# EAGLE design oneKey_2020 (EAGLE 9.6.2)
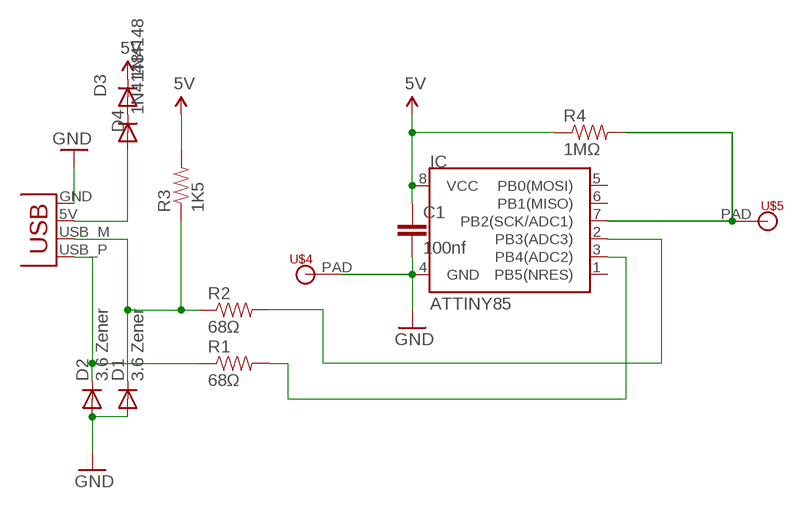
[diagram p0: schematic, sheet 1]

## Parts
C1  100nf  CAPKIT  [CAP-PTH-SMALL-KIT]
D1  3.6 Zener  1N4148  [DO35-10]
D2  3.6 Zener  1N4148  [DO35-10]
D3  1N4148  [DO35-10]
D4  1N4148  [DO35-10]
IC  ATTINY85  ATTINY45DIP8  [DIP08]
R1  68Ω  RESISTORAXIAL-0.3  [AXIAL-0.3]
R2  68Ω  RESISTORAXIAL-0.3  [AXIAL-0.3]
R3  1K5  RESISTORAXIAL-0.3  [AXIAL-0.3]
R4  1MΩ  RESISTORAXIAL-0.3  [AXIAL-0.3]
U$4  MICROBIT_PAD  [MICROBIT_PAD]
U$5  MICROBIT_PAD  [MICROBIT_PAD]
X1  USBPCB  [USB-A-PCB]

## Nets
5V: C1.1 D3.C IC.8(VCC) R3.P$2 R4.P$1
GND: C1.2 D1.A D2.A IC.4(GND) U$4.PAD X1.GND
N$1: IC.2(PB3(ADC3)) R2.P$2
N$2: IC.7(PB2(SCK/ADC1)) R4.P$2 U$5.PAD
N$3: D3.A D4.C
N$4: D4.A X1.5V(VBUS)
N$6: IC.3(PB4(ADC2)) R1.P$2
N$10: D1.C R2.P$1 R3.P$1 X1.USB_M(D-)
N$11: D2.C R1.P$1 X1.USB_P(D+)
Unconnected: IC.1(PB5(NRES)) IC.5(PB0(MOSI)) IC.6(PB1(MISO))

## Library data of the parts
C1 = SparkFun:CAP: Capacitor Standard 0603 ceramic capacitor, and 0.1" leaded capacitor.
D1-D4 = diode:1N4148: DIODE high speed (Philips)
IC = SparkFun:ATTINY45: Atmel ATTiny45
R1-R4 = SparkFun:RESISTOR: Resistor Basic schematic elements and footprints for 0603, 1206, and PTH resistors.
U$4 U$5 = microbit:MICROBIT_PAD
X1 = SparkFun:USB: USB Connectors USB-B-PTH is fully proven SKU : PRT-00139 USB-miniB is fully proven SKU : PRT-00587 USB-A-PCB is untested. USB-A-H is throughly reviewed, but untested. Spark Fun Electronics SKU : PRT-00437 USB-B-SMT is throughly reviewed, but untested. Needs silkscreen touching up. USB-A-S has not been used/tested USB-MB-H has not been used/tested

## Board
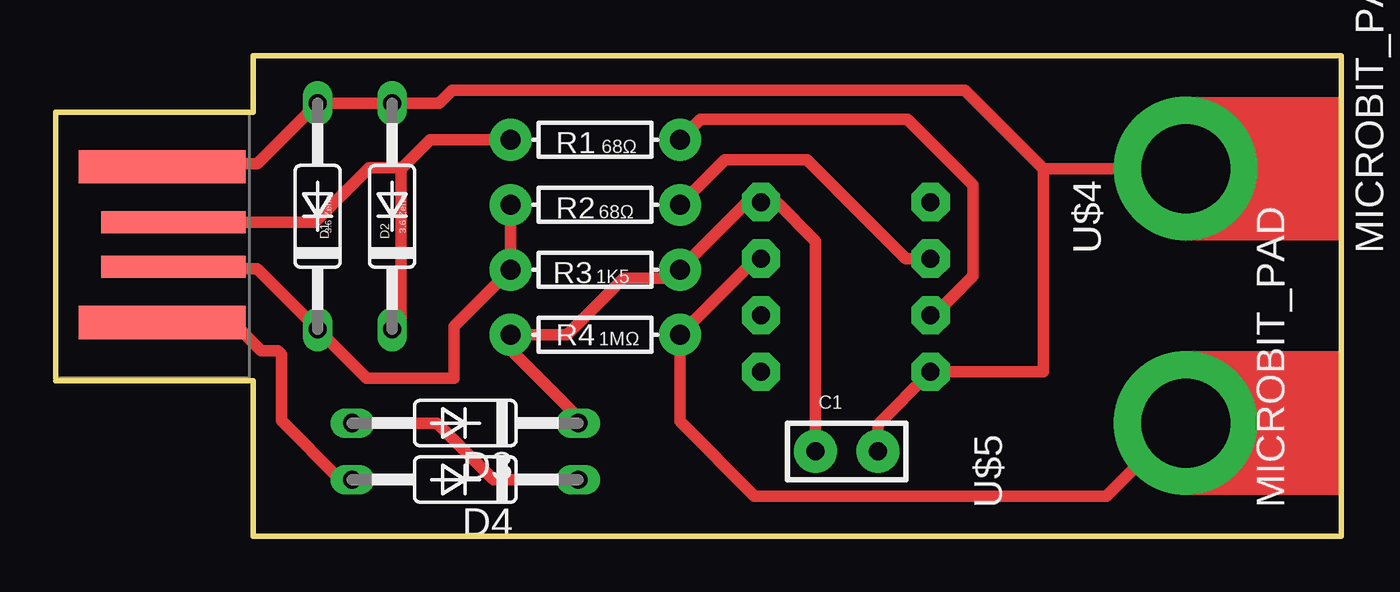
[diagram p1: board, top side]
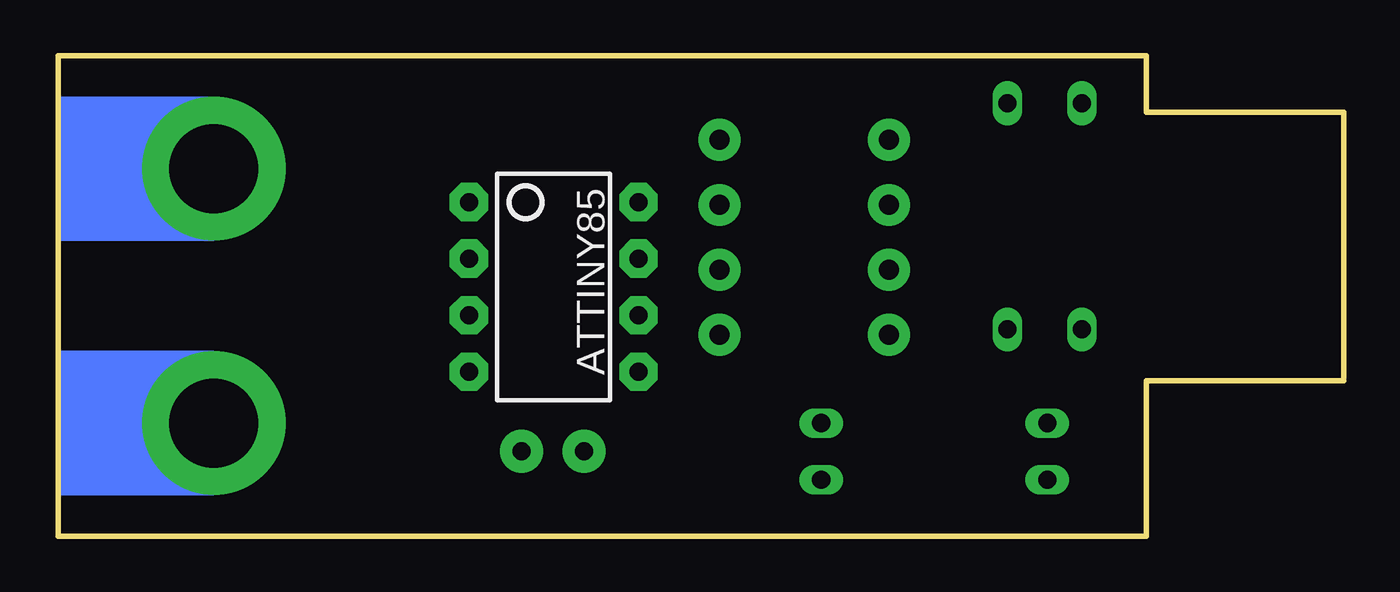
[diagram p2: board, bottom side, seen from below]

Size 57.79 x 21.59 mm. Coordinates in mm from the lower left corner, seen from the top.
Outline: 0,7.11 0,19.05 8.89,19.05 8.89,21.59 57.79,21.59 57.79,0 8.89,0 8.89,6.99 0,6.99
Copper layers (1*16): Top 0.035mm / dielectric 1.5mm / Bottom 0.035mm
Design rules "OthermillDRC_1_32_v2 *": minimum track width 20mil, minimum drill 0.8mm, track to track 0.794003125mm, track to pad 0.794003125mm, pad to pad 0.794003125mm, via to via 0.794003125mm, smd to smd 0mil, copper to edge 0mil, drill to drill 1mil, minimum pad ring 10mil, minimum via ring 10mil, stop-mask expansion 1mil, vias tented up to drill 30mil, thermal gap 10mil

### Footprints (pad centres in the part's own frame; a part is rotated, then mirrored left to right if it is on the bottom)
CAP-PTH-SMALL-KIT = drill 0.813 pad 1.93: 1 -1.397,0; 2 1.397,0
DO35-10 = drill 0.813 long: A 5.08,0; C -5.08,0
DIP08 = drill 0.813 pad 1.727 octagon: 1 -3.81,-3.81; 2 -1.27,-3.81; 3 1.27,-3.81; 4 3.81,-3.81; 5 3.81,3.81; 6 1.27,3.81; 7 -1.27,3.81; 8 -3.81,3.81
AXIAL-0.3 = drill 0.9 pad 1.88: P$1 -3.81,0; P$2 3.81,0
MICROBIT_PAD = drill 4 pad 6.452: PAD 0,0
USB-A-PCB = smd 7.5 x 1.5: 5V -0.2,-3.5; GND -0.2,3.5 | smd 6.5 x 1: USB_M 0.3,-1; USB_P 0.3,1

### Placement (x,y rotation side)
C1  35.56,3.81 0 top
D1  11.78,14.37 90 top
D2  15.12,14.37 90 top
D3  18.41,5.08 180 top
D4  18.41,2.54 180 top
IC  35.52,11.19 270 bottom
R1  24.26,17.82 0 top
R2  24.26,14.88 0 top
R3  24.26,11.97 0 top
R4  24.26,9.05 0 top
U$4  50.8,16.51 90 top
U$5  50.8,5.08 90 top
X1  5,13.1 0 top

### Tracks (layer width: path | path; a pad name or v marks a point on that pad's centre or on a via)
5V
  Top 0.508: D3.C 23.5,5.33 20.45,8.38 R4.P$1 22.99,9.05 25.53,11.59 28.07,11.59 R3.P$2 28.07,12 31.07,15 IC.8 32.42,15 34.16,13.26 C1.1
GND
  Top 0.508: 44.41,16.51 44.41,7.38 IC.4 36.96,5.01 C1.2 | U$4.PAD 44.41,16.51 | X1.GND 4.94,16.74 9.07,16.74 D1.A D2.A 17.24,19.45 17.83,20.04 40.88,20.04 44.41,16.51
N$1
  Top 0.508: IC.2 38.22,12.46 33.77,16.92 30.1,16.92 R2.P$2
N$2
  Top 0.508: IC.7 31.48,12.46 R4.P$2 28.07,5.15 31.42,1.8 47.24,1.8 50.52,5.08 U$5.PAD
N$3
  Top 0.508: D4.C 19.68,2.54 17.14,5.08 D3.A
N$4
  Top 0.508: X1.5V 7.97,9.6 9.24,8.33 9.99,8.33 10.16,8.16 10.16,5.18 12.8,2.54 D4.A
N$6
  Top 0.508: IC.3 39.49,9.92 41.24,11.67 41.24,15.8 38.3,18.74 28.99,18.74 R1.P$2
N$10
  Top 0.508: R2.P$1 R3.P$1 17.91,9.43 17.91,7.09 13.98,7.09 D1.C 9.05,12.01 5.38,12.01 X1.USB_M
N$11
  Top 0.508: D2.C 15.54,9.7 15.54,16.51 | 15.54,16.51 15.54,16.55 14.1,16.55 11.65,14.1 X1.USB_P | 15.54,16.51 16.84,17.82 R1.P$1

### Text on the board
Reference: Design (schematic, layout, concept) is licensed under the Creative Commons Attribution-ShareAlike 3.0 Unported License: http://creativecommons.org/licenses/by-sa/3.0/ | For full details and license information please see https://github.com/makerjawn/oneKey | Derivative of MaKey MaKey by JoyLabz and Sparkfun and the Digispark | Created by bk, klvnc.me 2015